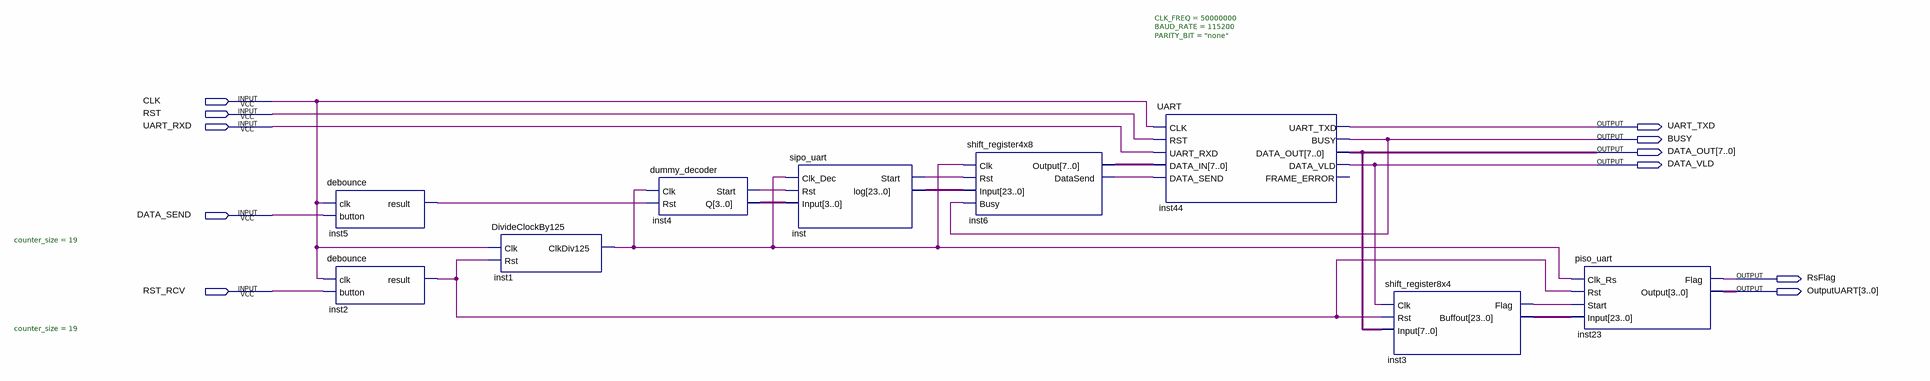
[diagram p0: schematic sheet]
// Quartus schematic simple_uart_for_fpga.bdf as structural Verilog: 9 symbols, 11 pins
module simple_uart_for_fpga (
  input  CLK,
  input  RST,
  input  UART_RXD,
  input  DATA_SEND,
  input  RST_RCV,
  output UART_TXD,
  output BUSY,
  output [7:0] DATA_OUT,
  output DATA_VLD,
  output RsFlag,
  output [3:0] OutputUART
);

  wire inst1_clkdiv125, inst2_result, inst3_flag, inst4_start, inst5_result, inst6_datasend, inst_start;
  wire [3:0] inst4_q;
  wire [7:0] inst6_output;
  wire [23:0] inst3_buffout, inst_log;

  debounce #(.counter_size(19)) inst5 (.clk(CLK), .button(DATA_SEND), .result(inst5_result));
  debounce #(.counter_size(19)) inst2 (.clk(CLK), .button(RST_RCV), .result(inst2_result));
  DivideClockBy125 inst1 (.Clk(CLK), .Rst(inst2_result), .ClkDiv125(inst1_clkdiv125));
  dummy_decoder inst4 (.Clk(inst1_clkdiv125), .Rst(inst5_result), .Start(inst4_start), .Q(inst4_q));
  sipo_uart inst (.Clk_Dec(inst1_clkdiv125), .Rst(inst4_start), .Input(inst4_q), .Start(inst_start), .log(inst_log));
  shift_register4x8 inst6 (
    .Clk(inst1_clkdiv125), .Rst(inst_start), .Input(inst_log), .Busy(BUSY), .Output(inst6_output),
    .DataSend(inst6_datasend));
  UART #(.CLK_FREQ(50000000), .BAUD_RATE(115200), .PARITY_BIT("none")) inst44 (
    .CLK(CLK), .RST(RST), .UART_RXD(UART_RXD), .DATA_IN(inst6_output), .DATA_SEND(inst6_datasend),
    .UART_TXD(UART_TXD), .BUSY(BUSY), .DATA_OUT(DATA_OUT), .DATA_VLD(DATA_VLD));  // open: FRAME_ERROR
  shift_register8x4 inst3 (
    .Clk(DATA_VLD), .Rst(inst2_result), .Input(DATA_OUT), .Flag(inst3_flag), .Buffout(inst3_buffout));
  piso_uart inst23 (
    .Clk_Rs(inst1_clkdiv125), .Rst(inst2_result), .Start(inst3_flag), .Input(inst3_buffout), .Flag(RsFlag),
    .Output(OutputUART));
endmodule
